# Altium schematic sheet NutriTechPot Schematic.SchDoc
size A; SheetNumber: 1; SheetTotal: 1; SPICEModelCacheIHBTWADN: <root> / <DocumentId>IHBTWADN</DocumentId> / </root>
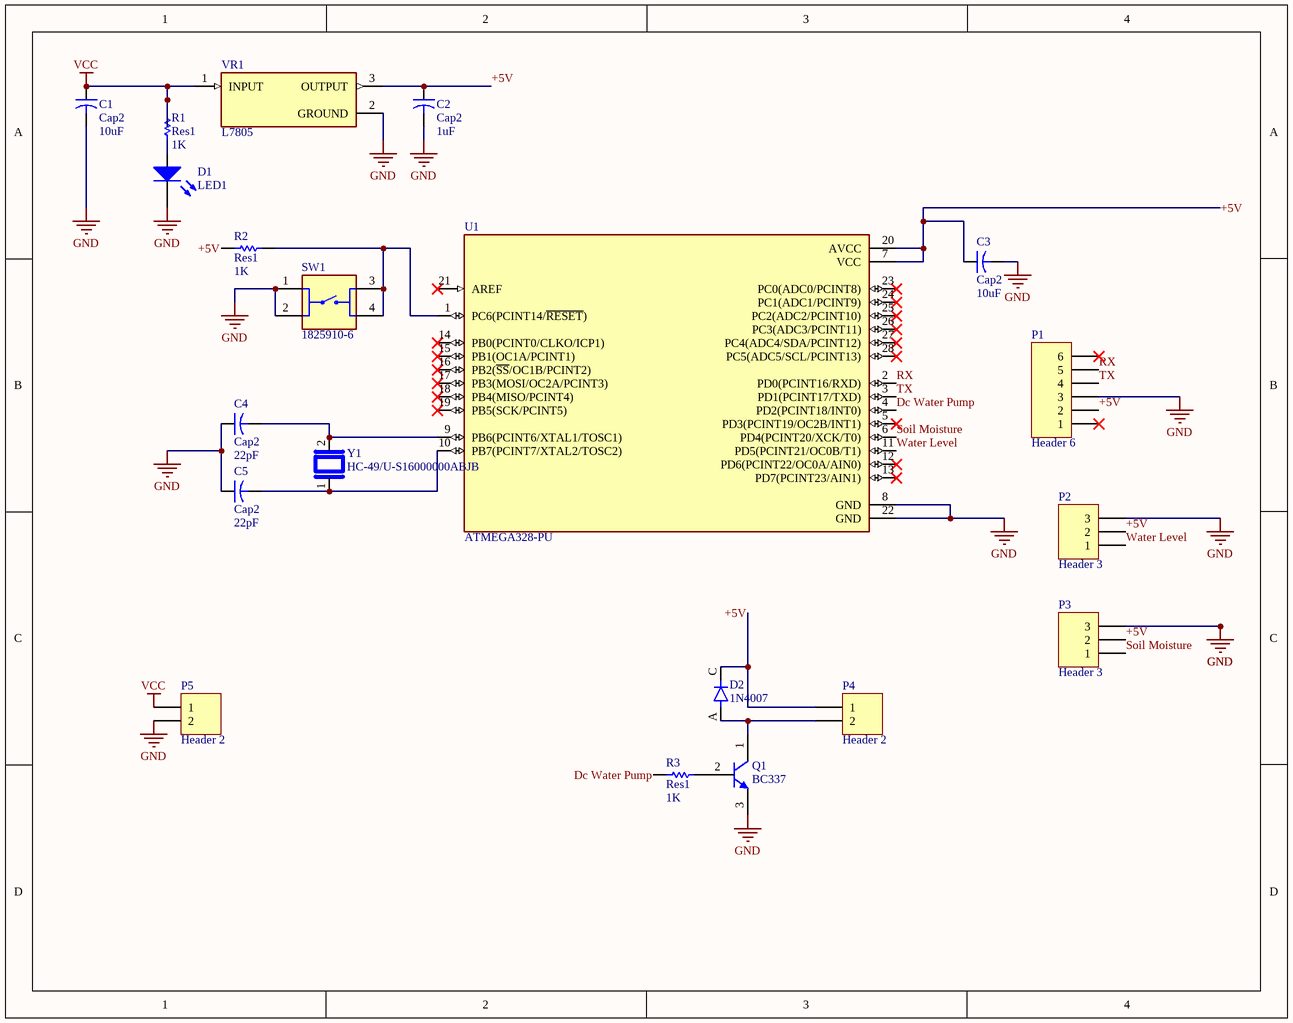
[diagram p0: NutriTechPot Schematic.SchDoc]

## Parts
C1  Cap2  value 10uF  [CAPR5-4X5]
C2  Cap2  value 1uF  [CAPR5-4X5]
C3  Cap2  value 10uF  [CAPR5-4X5]
C4  Cap2  value 22pF  [CAPR5-4X5]
C5  Cap2  value 22pF  [CAPR5-4X5]
D1  LED1  [LED-1]
D2  1N4007  [DIOAD1060W80L520D270]
P1  Header 6  [HDR1X6]
P2  Header 3  [HDR1X3]
P3  Header 3  [HDR1X3]
P4  Header 2  [HDR1X2]
P5  Header 2  [HDR1X2]
Q1  BC337  [ONSC-TO-92-3-29-11]
R1  Res1  value 1K  [AXIAL-0.3]
R2  Res1  value 1K  [AXIAL-0.3]
R3  Res1  value 1K  [AXIAL-0.3]
SW1  1825910-6  [SW_1825910-6-4]
U1  ATMEGA328-PU  [DIP787W46P254L3467H508Q28]
VR1  L7805  [TO255P1020X450X2000-3]
Y1  HC-49/U-S16000000ABJB  [XTAL_HC49P488W43L1150T466H350]

## Nets
GND: C1.2 C2.2 C3.2 C4.1 C5.1 D1.2(K) P1.3 P2.3 P3.3 P5.2 Q1.3(E) SW1.1 SW1.2 U1.8(GND) U1.22(GND) VR1.2(GROUND)
VCC: C1.1 P5.1 R1.2 VR1.1(INPUT)
+5V: C2.1 C3.1 D2.C P1.2 P2.2 P3.2 P4.1 R2.1 U1.7(VCC) U1.20(AVCC) VR1.3(OUTPUT)
Dc Water Pump: R3.1 U1.4(PD2(PCINT18/INT0))
RX: P1.5 U1.2(PD0(PCINT16/RXD))
Soil Moisture: P3.1 U1.6(PD4(PCINT20/XCK/T0))
TX: P1.4 U1.3(PD1(PCINT17/TXD))
Water Level: P2.1 U1.11(PD5(PCINT21/OC0B/T1))
NetC4_2: C4.2 U1.9(PB6(PCINT6/XTAL1/TOSC1)) Y1.2
NetC5_2: C5.2 U1.10(PB7(PCINT7/XTAL2/TOSC2)) Y1.1
NetD1_1: D1.1(A) R1.1
NetD2_A: D2.A P4.2 Q1.1(C)
NetQ1_2: Q1.2(B) R3.2
NetR2_2: R2.2 SW1.3 SW1.4 U1.1(PC6(PCINT14/~{RESET}))

Not connected (* = marked no-connect by the designer): P1 1* 6*; U1 5(PD3(PCINT19/OC2B/INT1))* 12(PD6(PCINT22/OC0A/AIN0))* 13(PD7(PCINT23/AIN1))* 14(PB0(PCINT0/CLKO/ICP1))* 15(PB1(OC1A/PCINT1))* 16(PB2(~{SS}/OC1B/PCINT2))* 17(PB3(MOSI/OC2A/PCINT3))* 18(PB4(MISO/PCINT4))* 19(PB5(SCK/PCINT5))* 21(AREF)* 23(PC0(ADC0/PCINT8))* 24(PC1(ADC1/PCINT9))* 25(PC2(ADC2/PCINT10))* 26(PC3(ADC3/PCINT11))* 27(PC4(ADC4/SDA/PCINT12))* 28(PC5(ADC5/SCL/PCINT13))*

## Library data of the parts
C1-C5 = Cap2: Capacitor; Published: 23-Sep-2002; PackageReference: CAPR5-4X5; Publisher: Altium Limited; PackageDescription: Capacitor; 2 Leads
D1 = LED1: Typical RED GaAs LED; Published: 8-Jun-2000; LatestRevisionDate: 08-Jul-2005; LatestRevisionNote: Mech Layer 1 removed.; PackageReference: LED-1; Publisher: Altium Limited; PackageDescription: LED; 2 Leads
D2 = 1N4007: Diode Standard 1000 V 1A Through Hole DO-41; MF: NTE Electronics, Inc.; Package: DO-41 NTE Electronics; Check_prices: https://www.snapeda.com/parts/1N4007/NTE+Electronics/view-part/?ref=eda; Value: *; Purchase-URL: https://pricing.snapeda.com/search/part/1N4007/?ref=eda; Availability: In Stock; SnapEDA_Link: https://www.snapeda.com/parts/1N4007/NTE+Electronics/view-part/?ref=snap; MP: 1N4007; Price: None
P1 = Header 6: Header, 6-Pin; LatestRevisionDate: 17-Jul-2002; LatestRevisionNote: Re-released for DXP Platform.; Publisher: Altium Limited
P2 P3 = Header 3: Header, 3-Pin; LatestRevisionDate: 17-Jul-2002; LatestRevisionNote: Re-released for DXP Platform.; Publisher: Altium Limited
P4 P5 = Header 2: Header, 2-Pin; LatestRevisionDate: 17-Jul-2002; LatestRevisionNote: Re-released for DXP Platform.; Publisher: Altium Limited
Q1 = CMP-1048-01458-1: Amplifier Transistor, NPN Silicon, 3-Pin TO-92, Bulk Box; Manufacturer: On Semiconductor; Note1: 0; IC Continuous (A): 0.8; ComponentLink1URL: http://www.onsemi.com/; PackageDescription: 3-Pin Transistor Outline, Body 4.825 x 3.685 mm, Pitch 1.27 mm; ComponentLink3URL: http://www.onsemi.cn/pub_link/Collateral/2N6426-D.PDF; ComponentLink1Description: Manufacturer URL; PackageVersion: Rev. AM; Polarity: NPN; PackageReference: TO-92-3-29-11_AM_SL; DatasheetVersion: Rev. 8; ComponentLink2URL: http://www.onsemi.com/pub_link/Collateral/BC337-D.PDF; Packing: Bulk Box; PartNumber: BC337; RoHS: FALSE; ComponentLink3Description: Package Specification; Mounting Technology: Through Hole; ComponentLink2Description: Datasheet
R1-R3 = Res1: Resistor; Published: 8-Jun-2000; LatestRevisionDate: 17-Jul-2002; LatestRevisionNote: Re-released for DXP Platform.; PackageReference: AXIAL-0.3; Publisher: Altium Limited; PackageDescription: Axial Device, Thru-Hole; 2 Leads; 0.3 in Pin Spacing
SW1 = 1825910-6: Switch Push Button OFF (ON) SPST Round Button 0.05A 24VDC Momentary Contact PC Pins Thru-Hole; MF: TE Connectivity; Value: *; MP: 1825910-6; Package: None; Check_prices: https://www.snapeda.com/parts/1825910-6/TE+Connectivity+ALCOSWITCH+Switches/view-part/?ref=eda; SnapEDA_Link: https://www.snapeda.com/parts/1825910-6/TE+Connectivity+ALCOSWITCH+Switches/view-part/?ref=snap; Digi-Key_Part_Number: 450-1650-ND; Purchase-URL: https://pricing.snapeda.com/search/part/1825910-6/?ref=eda
U1 = ATMEGA328-PU: AVR AVRÂ® ATmega Microcontroller IC 8-Bit 20MHz 32KB (16K x 16) FLASH 28-PDIP; MF: Microchip; Availability: In Stock; MP: ATMEGA328-PU; SnapEDA_Link: https://www.snapeda.com/parts/ATMEGA328-PU/Microchip/view-part/?ref=snap; Value: *; Price: None; Purchase-URL: https://pricing.snapeda.com/search/part/ATMEGA328-PU/?ref=eda; Check_prices: https://www.snapeda.com/parts/ATMEGA328-PU/Microchip/view-part/?ref=eda; Package: DIP-28 Microchip Technology
VR1 = L7805: Standard Regulator Pos 5V 1.5A 3-Pin(3+Tab) TO-220FP Tube; MF: STMicroelectronics; MP: L7805; Value: *; SnapEDA_Link: https://www.snapeda.com/parts/L7805/STMicroelectronics/view-part/?ref=snap; Price: None; Package: None; Check_prices: https://www.snapeda.com/parts/L7805/STMicroelectronics/view-part/?ref=eda; Availability: Not in stock
Y1 = HC-49/U-S16000000ABJB: 16 MHz Â±30ppm Crystal 18pF 50 Ohms HC-49/US; MF: Citizen Finedevice Co Ltd; Value: *; SnapEDA_Link: https://www.snapeda.com/parts/HC-49/U-S16000000ABJB/Citizen+Finedevice+Co+Ltd/view-part/?ref=snap; Purchase-URL: https://pricing.snapeda.com/search/part/HC-49/U-S16000000ABJB/?ref=eda; Availability: In Stock; Price: None; Package: HC-49/US Citizen Finetech Miyota; Check_prices: https://www.snapeda.com/parts/HC-49/U-S16000000ABJB/Citizen+Finedevice+Co+Ltd/view-part/?ref=eda; MP: HC-49/U-S16000000ABJB